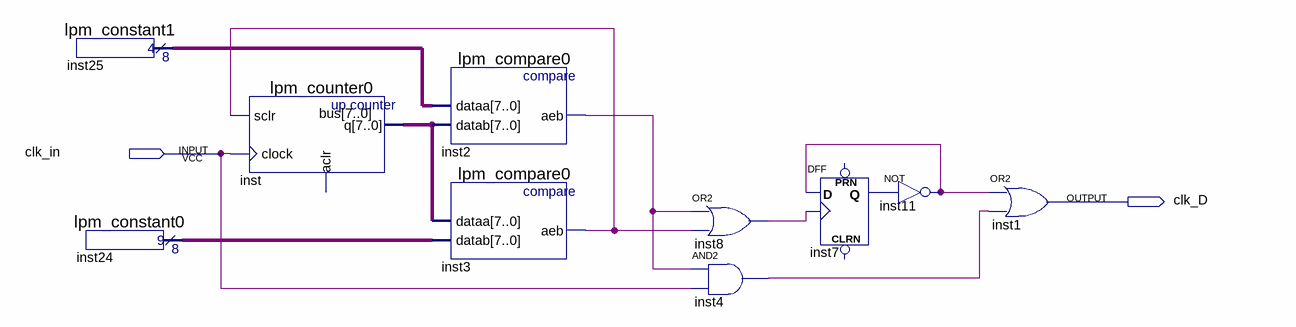
[diagram p0: schematic sheet]
// Quartus schematic Block2.bdf as structural Verilog: 10 symbols, 2 pins
module Block2 (
  input  clk_in,
  output clk_D
);

  wire inst2_aeb, inst3_aeb, inst4_out, inst7_q, inst8_out, inst11_out;
  wire [7:0] bus, inst24_result, inst25_result;

  lpm_constant1 inst25 (.result(inst25_result));
  lpm_constant0 inst24 (.result(inst24_result));
  lpm_counter0 inst (.sclr(inst3_aeb), .clock(clk_in), .q(bus));  // open: aclr
  lpm_compare0 inst2 (.dataa(inst25_result), .datab(bus), .aeb(inst2_aeb));
  lpm_compare0 inst3 (.dataa(bus), .datab(inst24_result), .aeb(inst3_aeb));
  or inst8 (inst8_out, inst2_aeb, inst3_aeb);
  and inst4 (inst4_out, inst2_aeb, clk_in);
  DFF inst7 (.CLK(inst8_out), .D(inst11_out), .Q(inst7_q));  // open: CLRN, PRN
  not inst11 (inst11_out, inst7_q);
  or inst1 (clk_D, inst11_out, inst4_out);
endmodule
